# Altium schematic sheet Sheet1.SchDoc
size A4; SheetNumber: 1; SheetTotal: 6
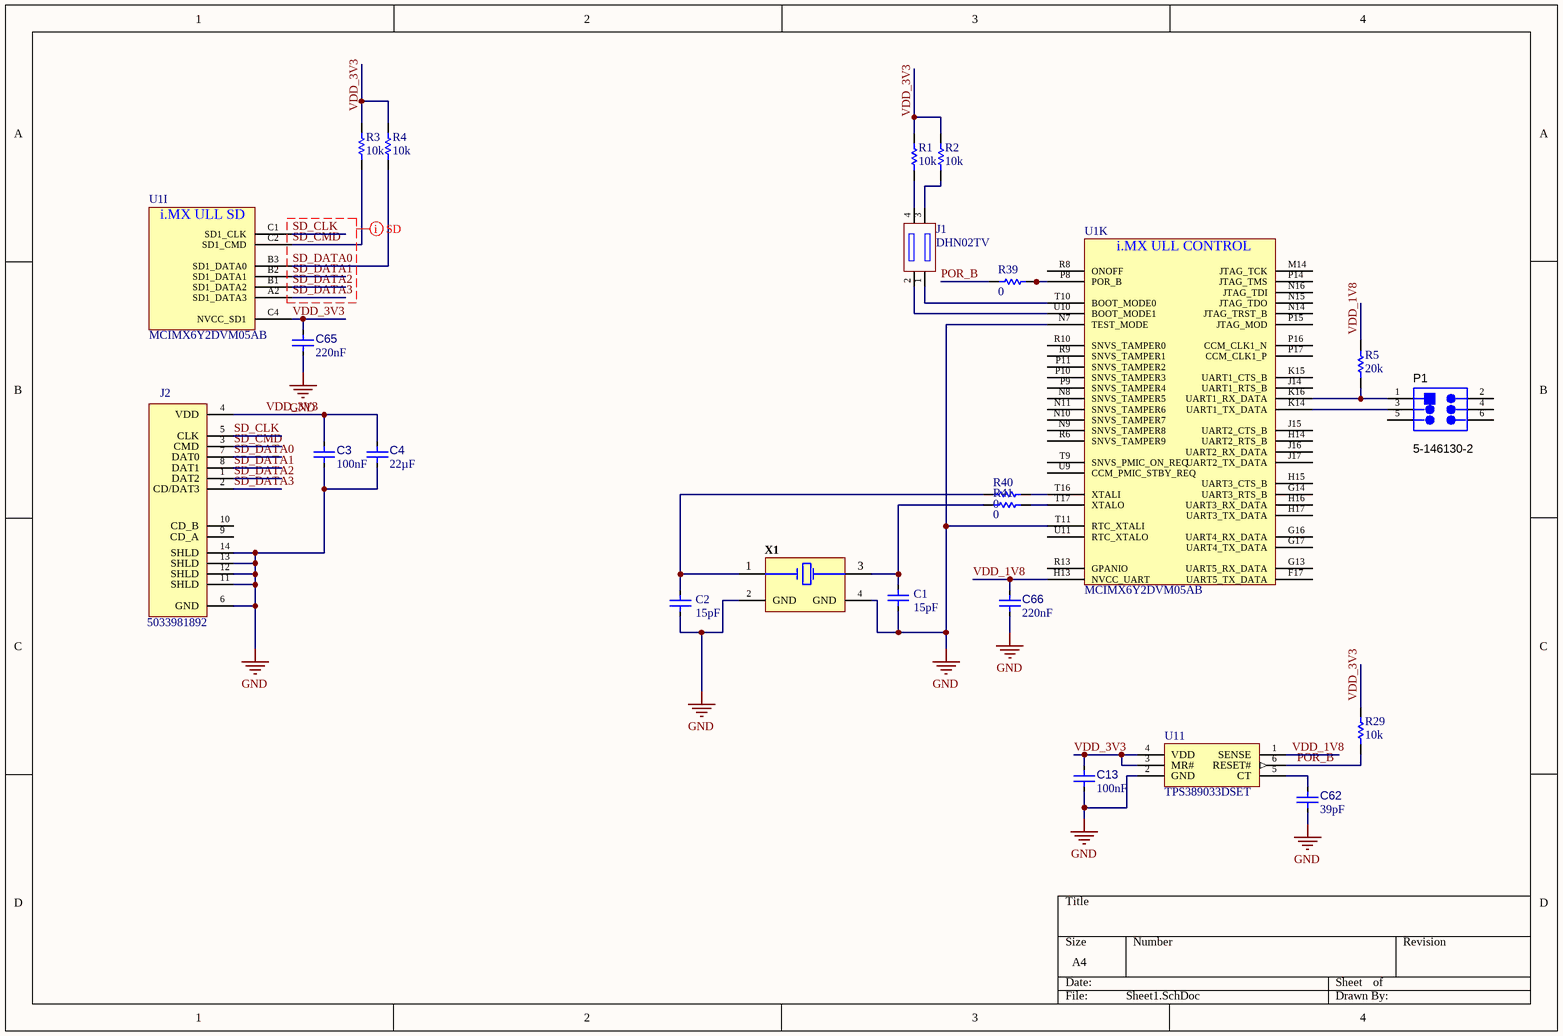
[diagram p0: Sheet1.SchDoc]

## Parts
C1  value 15pF  [0402-SMD-CAP]  (hidden comment: C0402C150J3GACTU)
C2  value 15pF  [0402-SMD-CAP]  (hidden comment: C0402C150J3GACTU)
C3  value 100nF  [0402-SMD-CAP]  (hidden comment: EMF105B7104MVHF)
C4  value 22µF  [0805-SMD-CAP]  (hidden comment: CL21A226MOQNNNE)
C13  value 100nF  [0402-SMD-CAP]  (hidden comment: EMF105B7104MVHF)
C62  value 39pF  [0402-SMD-CAP]  (hidden comment: GRM1555C1H390JA01D)
C65  value 220nF  [0402-SMD-CAP]  (hidden comment: GRM155R71C224KA12D)
C66  value 220nF  [0402-SMD-CAP]  (hidden comment: GRM155R71C224KA12D)
J1  DHN02TV  [DHN02TV-Footprint-1]
J2  5033981892  [MOLX-5033981892_V]
P1  5-146130-2  [TECO-5-146130-2_V]
R1  value 10k  [0402_SMD_RES]  (hidden comment: Resistor 10k +/-1% 0402 63 mW)
R2  value 10k  [0402_SMD_RES]  (hidden comment: Resistor 10k +/-1% 0402 63 mW)
R3  value 10k  [0402_SMD_RES]  (hidden comment: Resistor 10k +/-1% 0402 63 mW)
R4  value 10k  [0402_SMD_RES]  (hidden comment: Resistor 10k +/-1% 0402 63 mW)
R5  value 20k  [0603-SMD-RES]  (hidden comment: CRCW060320K0FKEA)
R29  value 10k  [0402_SMD_RES]  (hidden comment: Resistor 10k +/-1% 0402 63 mW)
R39  value 0  [0402_SMD_RES]  (hidden comment: RCS04020000Z0ED)
R40  value 0  [0402_SMD_RES]  (hidden comment: RCS04020000Z0ED)
R41  value 0  [0402_SMD_RES]  (hidden comment: RCS04020000Z0ED)
U1  MCIMX6Y2DVM05AB  [BGA100P9X9-81A]  (parts I,K of 11)
U11  TPS389033DSET  [TPS389033DSET-Footprint-1]
X1  TSX-322524.0000MF15X-AC3  [EPSON-TSX-3225_V]  (value not drawn)

## Nets
GND: C1.2 C2.2 C3.1 C4.1 C13.1 C62.2 C65.2 C66.2 J2.6(GND) J2.11(SHLD) J2.12(SHLD) J2.13(SHLD) J2.14(SHLD) U1.N7(TEST_MODE) U1.T11(RTC_XTALI) U11.2(GND) X1.2(GND) X1.4(GND)
POR_B: R29.1 R39.1 U11.6(RESET#)
SD_CLK: J2.5(CLK) U1.C1(SD1_CLK)
SD_CMD: J2.3(CMD) R3.1 U1.C2(SD1_CMD)
SD_DATA0: J2.7(DAT0) R4.1 U1.B3(SD1_DATA0)
SD_DATA1: J2.8(DAT1) U1.B2(SD1_DATA1)
SD_DATA2: J2.1(DAT2) U1.B1(SD1_DATA2)
SD_DATA3: J2.2(CD/DAT3) U1.A2(SD1_DATA3)
VDD_1V8: C66.1 R5.2 U1.H13(NVCC_UART) U11.1(SENSE)
VDD_3V3: C3.2 C4.2 C13.2 C65.1 J2.4(VDD) R1.2 R2.2 R3.2 R4.2 R29.2 U1.C4(NVCC_SD1) U11.3(MR#) U11.4(VDD)
NetC1_1: C1.1 R41.1 X1.3(X2)
NetC2_1: C2.1 R40.1 X1.1(X1)
NetC62_1: C62.1 U11.5(CT)
NetJ1_1: J1.1 U1.T10(BOOT_MODE0)
NetJ1_2: J1.2 U1.U10(BOOT_MODE1)
NetJ1_3: J1.3 R2.1
NetJ1_4: J1.4 R1.1
NetP1_1: P1.1 R5.1 U1.K16(UART1_RX_DATA)
NetP1_3: P1.3 U1.K14(UART1_TX_DATA)
NetR39_2: R39.2 U1.P8(POR_B)
NetR40_2: R40.2 U1.T16(XTALI)
NetR41_2: R41.2 U1.T17(XTALO)

Not connected (* = marked no-connect by the designer): J2 9(CD_A) 10(CD_B); P1 2 4 5 6; U1 F17(UART5_TX_DATA) G13(UART5_RX_DATA) G14(UART3_RTS_B) G16(UART4_RX_DATA) G17(UART4_TX_DATA) H14(UART2_RTS_B) H15(UART3_CTS_B) H16(UART3_RX_DATA) H17(UART3_TX_DATA) J14(UART1_RTS_B) J15(UART2_CTS_B) J16(UART2_RX_DATA) J17(UART2_TX_DATA) K15(UART1_CTS_B) M14(JTAG_TCK) N8(SNVS_TAMPER5) N9(SNVS_TAMPER8) N10(SNVS_TAMPER7) N11(SNVS_TAMPER6) N14(JTAG_TRST_B) N15(JTAG_TDO) N16(JTAG_TDI) P9(SNVS_TAMPER4) P10(SNVS_TAMPER3) P11(SNVS_TAMPER2) P14(JTAG_TMS) P15(JTAG_MOD) P16(CCM_CLK1_N) P17(CCM_CLK1_P) R6(SNVS_TAMPER9) R8(ONOFF) R9(SNVS_TAMPER1) R10(SNVS_TAMPER0) R13(GPANIO) T9(SNVS_PMIC_ON_REQ) U9(CCM_PMIC_STBY_REQ) U11(RTC_XTALO)

## Layout directives
net class SD; rule Matched Net Lengths [Delay Tolerance = 100ps]: SD_CLK, SD_CMD, SD_DATA0, SD_DATA1, SD_DATA2, SD_DATA3

## Notes on the sheet
- (in symbol CMP-003-000001-14, part I) i.MX ULL SD
- (in symbol CMP-003-000001-14, part K) i.MX ULL CONTROL

## Library data of the parts
C1 C2 = CMP-001-00085-9: Cap Ceramic 15pF 25V C0G 5% SMD 0402 125C Paper T/R; Tolerance: 5%; Voltage Rating: 25V; Capacitor Type: Ceramic
C3 C13 = CMP-001-00001-14: Chip Capacitor, 0.1 uF, +/- 5%, 16 V, 0402 (1005 Metric); Capacitor Type: Ceramic; Voltage Rating: 16V; Case/Package: 0402; Max Operating Temperature: 125°C; Mounting Technology: SM; RoHS Compliant: True; Pins: 2; Min Operating Temperature: -55°C; Tolerance: 5%; Mfr. Part No.: EMF105B7104MVHF
C4 = CMP-001-00081-10: Chip Capacitor, 22µF +/-40%, 16V, 0805, Thickness 1.45 mm; Tolerance: 5%; Min Operating Temperature: -55°C; Case/Package: 0805; Max Operating Temperature: 85°C; Pins: 2; Mounting Technology: SMT; Voltage Rating: 16V; Mfr. Part No.: CL21A226MOQNNNE
C62 = CMP-001-00088-5: Cap Ceramic 39pF 50V C0G 5% SMD 0402 125C Paper T/R; Temperature Coefficient: 30ppm/°C; Capacitance: 39pF; Case/Package: 0402; Package Quantity: 10000; Series: GRM; Termination: SMD/SMT; Width: 0.02inch; Dielectric: C0G; Thickness: 0.022inch; Construction: Flat; Min Operating Temperature: -55°C; Case Code (Imperial): 0402; Radiation Hardening: No; Voltage: 50V; Number of Pins: 2; Lead Free: Lead Free; Height: 0.5mm; Depth: 0.5mm; Material: Ceramic; Length: 1mm; REACH SVHC: No SVHC; Packaging: Tape and Reel; Max Operating Temperature: 125°C; Voltage Rating (DC): 50V; Case Code (Metric): 1005; Mount: Surface Mount; Voltage Rating: 50V; Tolerance: 5%
C65 C66 = CMP-001-00090-10: MURATA - GRM155R71C224KA12D - SMD Multilayer Ceramic Capacitor, 0.22 µF, 16 V, 0402 [1005 Metric], ± 10%, X7R, GRM Series; Voltage: 16V; Package Quantity: 1; Height: 0.5mm; Tolerance: 10%; Case/Package: 0402; Case Code (Metric): 1005; Packaging: Tape and Reel; Min Operating Temperature: -55°C; Mount: Surface Mount; RoHS Compliant: Yes; Thickness: 0.022inch; Depth: 0.5mm; Lead Free: Lead Free; Series: GRM; REACH SVHC: No SVHC; Width: 0.02inch; Voltage Rating: 16V; Material: Ceramic; Radiation Hardening: No; Voltage Rating (DC): 16V; Capacitance: 220nF; Max Operating Temperature: 125°C; Length: 1mm; Construction: Flat; Dielectric: X7R; Termination: SMD/SMT; Case Code (Imperial): 0402
J1 = CMP-00003-7: 1/2 Pitch DIP Switch; Voltage Rating (DC): 50V; Number of Positions: 2; Min Operating Temperature: -40°C; Mount: Surface Mount; Max Operating Temperature: 85°C; Terminal Pitch: 1.27mm; Package Quantity: 125; Contact Material: Bronze; Contact Plating: Gold
J2 = CMP-002-00049-6: Micro SD Card Connector, Pitch 1.1 mm, 8 Position, Height 1.4 mm, -25 to 85 degC, RoHS, Tape and Reel; Pins: 14
P1 = CMP-002-00018-5: Male Header, Pitch 2.54 mm, 2 x 3 Position, Height 8.13 mm, -65 to 125 degC, RoHS, Tube; Manufacturer: TE Connectivity; Gender: Male; Min Operating Temperature: -65°C; Datasheet Version: Oct-15; Connector Type: Header; RoHS Compliant: Unknown; Max Operating Temperature: 125°C; Case/Package: 5-146130-2; Package Reference: 5-146130-2; Mounting Technology: SM; Manufacturer URL: http://www.te.com/; Package Description: Male Header, Pitch 2.54 mm, 2 x 3 Position, Height 8.13 mm; Datasheet URL: http://www.te.com/commerce/DocumentDelivery/DDEController?Action=showdoc&DocId=Customer+Drawing%7F146130%7FM%7Fpdf%7FEnglish%7FENG_CD_146130_M.pdf%7F5-146130-2
R1-R4 R29 = CMP-009-00019-13: Chip Resistor, 10 KOhm, +/- 1%, 63 mW, -55 to 155 degC, 0402 (1005 Metric); Voltage Rating: 50V; Power: 63mW; Min Operating Temperature: -55°C; Pins: 2; Case/Package: 0402; Max Operating Temperature: 155°C; Resistance: 10k; Mounting Technology: SM; RoHS Compliant: True; Tolerance: 1%
R5 = CMP-009-00191-5: VISHAY - CRCW060320K0FKEA - SMD Chip Resistor, 0603 [1608 Metric], 20 kohm, CRCW e3 Series, 75 V, Thick Film, 100 mW; Voltage Rating: 75V; Power Rating: 100mW; Temperature Coefficient: 100ppm/°C; Tolerance: 1%; Length: 1.55mm; Mount: Surface Mount; Number of Terminations: 2; Case Code (Imperial): 0603; Termination: SMD/SMT; Radiation Hardening: No; RoHS Compliant: Yes; Max Operating Temperature: 155°C; Lead Free: Lead Free; Series: CRCW; REACH SVHC: Unknown; Max Power Dissipation: 100mW; Depth: 0.85mm; Case/Package: 0603; Package Quantity: 5000; Case Code (Metric): 1608; Size Code: 0603; Width: 0.85mm; Contact Plating: Tin,Lead; Construction: Rectangular; Weight: 7.1E-05oz; Resistance: 20k; Military Standard: Not; Features: Automotive AEC-Q200; Min Operating Temperature: -55°C; Packaging: Tape and Reel; Resistor Type: Thick Film; Height: 0.45mm; Resistance Tolerance: 1%; Number of Pins: 2; Voltage Rating (DC): 75V
R39-R41 = CMP-009-00005-12: Chip Resistor, 0 Ohm, 0.1 W, -55 to 155 degC, 0402 (1005 Metric); Voltage Rating: 50V; Tolerance: 5%; Power: 100mW; Min Operating Temperature: -55°C; Mounting Technology: SM; RoHS Compliant: True; Max Operating Temperature: 155°C; Pins: 2; Case/Package: 0402; Mfr. Part No.: RCS04020000Z0ED
U1 = CMP-003-000001-14: Package: MAPBGA; Design Item ID: MCIMX6Y2DVM05AB; Mfr. Part Nr.: MCIMX6Y2DVM05AB; Source: Schlib1.SchLib
U11 = CMP-016-00010-6: TEXAS INSTRUMENTS         TPS389033DSET             Voltage Supervisor, 1.5V-5.5Vsupp., 3.17V threshold/30 s delay, Active-Low reset, WSON-6                          New; Min Supply Voltage: 1.5V; Max Supply Voltage: 5.5V; Quiescent Current: 2uA; Min Operating Temperature: -40°C; RoHS Compliant: Yes; Threshold Voltage: 3.17V; Max Operating Temperature: 125°C; Packaging: Cut Tape; Lead Free: Lead Free; Number of Pins: 6; REACH SVHC: No SVHC
X1 = CMP-003-00030-8: CRYSTAL 24.0000MHZ 9PF SMD